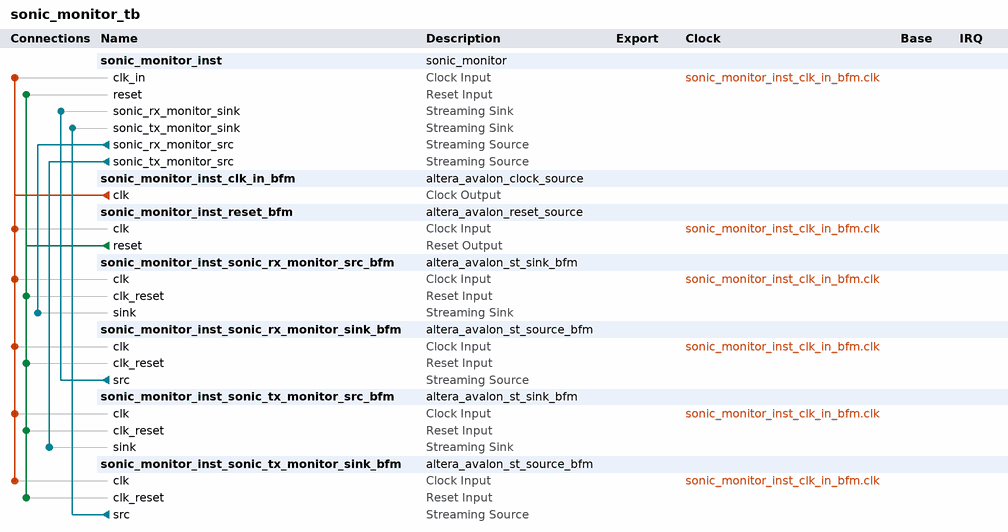
[diagram p0: system contents]
# Platform Designer (Qsys) system sonic_monitor_tb
# Parameters at their usual value, and those the tool derives, are not listed.
package require -exact qsys 11.0
create_system sonic_monitor_tb
set_project_property DEVICE_FAMILY STRATIXIV

add_instance sonic_monitor_inst sonic_monitor 1.0

add_instance sonic_monitor_inst_clk_in_bfm altera_avalon_clock_source 11.0
set_instance_parameter_value sonic_monitor_inst_clk_in_bfm CLOCK_RATE 250

add_instance sonic_monitor_inst_reset_bfm altera_avalon_reset_source 11.0
set_instance_parameter_value sonic_monitor_inst_reset_bfm ASSERT_HIGH_RESET 0
set_instance_parameter_value sonic_monitor_inst_reset_bfm INITIAL_RESET_CYCLES 50

add_instance sonic_monitor_inst_sonic_rx_monitor_src_bfm altera_avalon_st_sink_bfm 11.0
set_instance_parameter_value sonic_monitor_inst_sonic_rx_monitor_src_bfm USE_PACKET 1
set_instance_parameter_value sonic_monitor_inst_sonic_rx_monitor_src_bfm USE_CHANNEL 0
set_instance_parameter_value sonic_monitor_inst_sonic_rx_monitor_src_bfm USE_ERROR 1
set_instance_parameter_value sonic_monitor_inst_sonic_rx_monitor_src_bfm USE_READY 1
set_instance_parameter_value sonic_monitor_inst_sonic_rx_monitor_src_bfm USE_VALID 1
set_instance_parameter_value sonic_monitor_inst_sonic_rx_monitor_src_bfm USE_EMPTY 1
set_instance_parameter_value sonic_monitor_inst_sonic_rx_monitor_src_bfm ST_SYMBOL_W 32
set_instance_parameter_value sonic_monitor_inst_sonic_rx_monitor_src_bfm ST_NUMSYMBOLS 4
set_instance_parameter_value sonic_monitor_inst_sonic_rx_monitor_src_bfm ST_CHANNEL_W 1
set_instance_parameter_value sonic_monitor_inst_sonic_rx_monitor_src_bfm ST_ERROR_W 1
set_instance_parameter_value sonic_monitor_inst_sonic_rx_monitor_src_bfm ST_READY_LATENCY 0
set_instance_parameter_value sonic_monitor_inst_sonic_rx_monitor_src_bfm ST_MAX_CHANNELS 0

add_instance sonic_monitor_inst_sonic_rx_monitor_sink_bfm altera_avalon_st_source_bfm 11.0
set_instance_parameter_value sonic_monitor_inst_sonic_rx_monitor_sink_bfm USE_PACKET 1
set_instance_parameter_value sonic_monitor_inst_sonic_rx_monitor_sink_bfm USE_CHANNEL 0
set_instance_parameter_value sonic_monitor_inst_sonic_rx_monitor_sink_bfm USE_ERROR 1
set_instance_parameter_value sonic_monitor_inst_sonic_rx_monitor_sink_bfm USE_READY 1
set_instance_parameter_value sonic_monitor_inst_sonic_rx_monitor_sink_bfm USE_VALID 1
set_instance_parameter_value sonic_monitor_inst_sonic_rx_monitor_sink_bfm USE_EMPTY 1
set_instance_parameter_value sonic_monitor_inst_sonic_rx_monitor_sink_bfm ST_SYMBOL_W 32
set_instance_parameter_value sonic_monitor_inst_sonic_rx_monitor_sink_bfm ST_NUMSYMBOLS 4
set_instance_parameter_value sonic_monitor_inst_sonic_rx_monitor_sink_bfm ST_CHANNEL_W 1
set_instance_parameter_value sonic_monitor_inst_sonic_rx_monitor_sink_bfm ST_ERROR_W 1
set_instance_parameter_value sonic_monitor_inst_sonic_rx_monitor_sink_bfm ST_MAX_CHANNELS 0

add_instance sonic_monitor_inst_sonic_tx_monitor_src_bfm altera_avalon_st_sink_bfm 11.0
set_instance_parameter_value sonic_monitor_inst_sonic_tx_monitor_src_bfm USE_PACKET 1
set_instance_parameter_value sonic_monitor_inst_sonic_tx_monitor_src_bfm USE_CHANNEL 0
set_instance_parameter_value sonic_monitor_inst_sonic_tx_monitor_src_bfm USE_ERROR 1
set_instance_parameter_value sonic_monitor_inst_sonic_tx_monitor_src_bfm USE_READY 1
set_instance_parameter_value sonic_monitor_inst_sonic_tx_monitor_src_bfm USE_VALID 1
set_instance_parameter_value sonic_monitor_inst_sonic_tx_monitor_src_bfm USE_EMPTY 1
set_instance_parameter_value sonic_monitor_inst_sonic_tx_monitor_src_bfm ST_SYMBOL_W 32
set_instance_parameter_value sonic_monitor_inst_sonic_tx_monitor_src_bfm ST_NUMSYMBOLS 4
set_instance_parameter_value sonic_monitor_inst_sonic_tx_monitor_src_bfm ST_CHANNEL_W 1
set_instance_parameter_value sonic_monitor_inst_sonic_tx_monitor_src_bfm ST_ERROR_W 1
set_instance_parameter_value sonic_monitor_inst_sonic_tx_monitor_src_bfm ST_READY_LATENCY 0
set_instance_parameter_value sonic_monitor_inst_sonic_tx_monitor_src_bfm ST_MAX_CHANNELS 0

add_instance sonic_monitor_inst_sonic_tx_monitor_sink_bfm altera_avalon_st_source_bfm 11.0
set_instance_parameter_value sonic_monitor_inst_sonic_tx_monitor_sink_bfm USE_PACKET 1
set_instance_parameter_value sonic_monitor_inst_sonic_tx_monitor_sink_bfm USE_CHANNEL 0
set_instance_parameter_value sonic_monitor_inst_sonic_tx_monitor_sink_bfm USE_ERROR 1
set_instance_parameter_value sonic_monitor_inst_sonic_tx_monitor_sink_bfm USE_READY 1
set_instance_parameter_value sonic_monitor_inst_sonic_tx_monitor_sink_bfm USE_VALID 1
set_instance_parameter_value sonic_monitor_inst_sonic_tx_monitor_sink_bfm USE_EMPTY 1
set_instance_parameter_value sonic_monitor_inst_sonic_tx_monitor_sink_bfm ST_SYMBOL_W 32
set_instance_parameter_value sonic_monitor_inst_sonic_tx_monitor_sink_bfm ST_NUMSYMBOLS 4
set_instance_parameter_value sonic_monitor_inst_sonic_tx_monitor_sink_bfm ST_CHANNEL_W 1
set_instance_parameter_value sonic_monitor_inst_sonic_tx_monitor_sink_bfm ST_ERROR_W 1
set_instance_parameter_value sonic_monitor_inst_sonic_tx_monitor_sink_bfm ST_MAX_CHANNELS 0

# connections
add_connection sonic_monitor_inst_clk_in_bfm.clk sonic_monitor_inst.clk_in clock
add_connection sonic_monitor_inst_clk_in_bfm.clk sonic_monitor_inst_reset_bfm.clk clock
add_connection sonic_monitor_inst_clk_in_bfm.clk sonic_monitor_inst_sonic_rx_monitor_sink_bfm.clk clock
add_connection sonic_monitor_inst_clk_in_bfm.clk sonic_monitor_inst_sonic_rx_monitor_src_bfm.clk clock
add_connection sonic_monitor_inst_clk_in_bfm.clk sonic_monitor_inst_sonic_tx_monitor_sink_bfm.clk clock
add_connection sonic_monitor_inst_clk_in_bfm.clk sonic_monitor_inst_sonic_tx_monitor_src_bfm.clk clock
add_connection sonic_monitor_inst_reset_bfm.reset sonic_monitor_inst.reset reset
add_connection sonic_monitor_inst_reset_bfm.reset sonic_monitor_inst_sonic_rx_monitor_sink_bfm.clk_reset reset
add_connection sonic_monitor_inst_reset_bfm.reset sonic_monitor_inst_sonic_rx_monitor_src_bfm.clk_reset reset
add_connection sonic_monitor_inst_reset_bfm.reset sonic_monitor_inst_sonic_tx_monitor_sink_bfm.clk_reset reset
add_connection sonic_monitor_inst_reset_bfm.reset sonic_monitor_inst_sonic_tx_monitor_src_bfm.clk_reset reset
add_connection sonic_monitor_inst.sonic_rx_monitor_src sonic_monitor_inst_sonic_rx_monitor_src_bfm.sink avalon_streaming
add_connection sonic_monitor_inst.sonic_tx_monitor_src sonic_monitor_inst_sonic_tx_monitor_src_bfm.sink avalon_streaming
add_connection sonic_monitor_inst_sonic_rx_monitor_sink_bfm.src sonic_monitor_inst.sonic_rx_monitor_sink avalon_streaming
add_connection sonic_monitor_inst_sonic_tx_monitor_sink_bfm.src sonic_monitor_inst.sonic_tx_monitor_sink avalon_streaming

save_system sonic_monitor_tb.qsys
